# Altium schematic sheet STM32.SchDoc
size A4
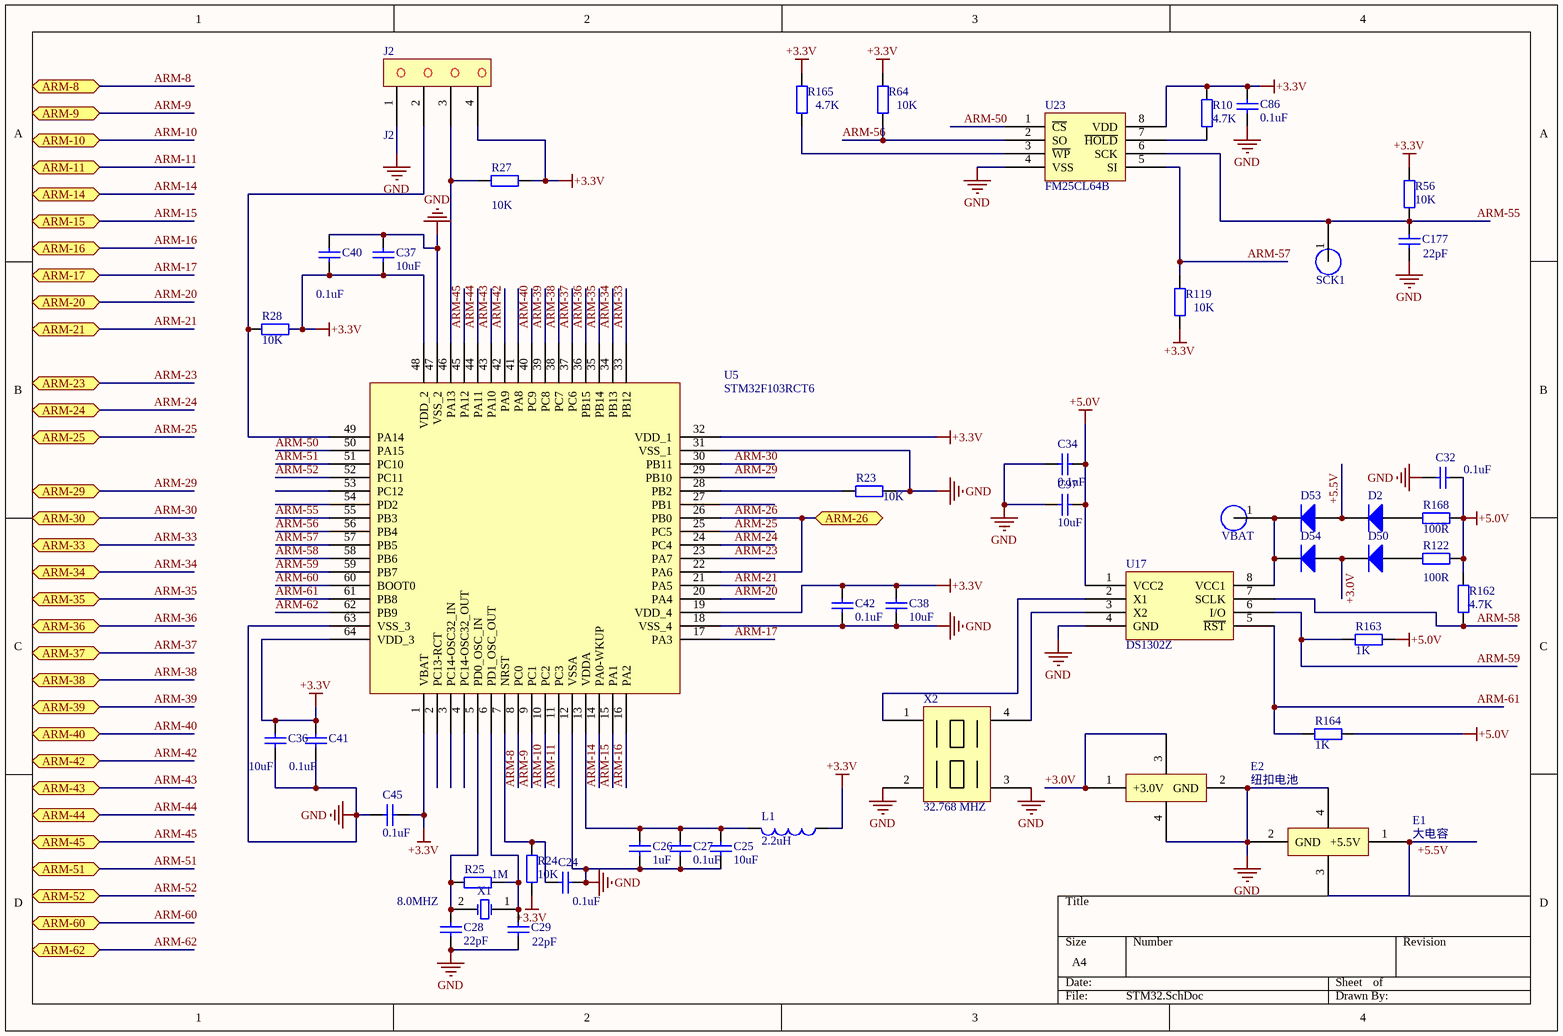
[diagram p0: STM32.SchDoc]

## Parts
C24  value 0.1uF  [C0805]  (hidden comment: Cap)
C25  value 10uF  [C1206]  (hidden comment: Cap)
C26  value 1uF  [C0805]  (hidden comment: Cap)
C27  value 0.1uF  [C0805]  (hidden comment: Cap)
C28  value 22pF  [C0805]  (hidden comment: Cap)
C29  value 22pF  [C0805]  (hidden comment: Cap)
C32  value 0.1uF  [C0805]  (hidden comment: Cap)
C34  value 0.1uF  [C0805]  (hidden comment: Cap)
C36  value 10uF  [C1206]  (hidden comment: Cap)
C37  value 10uF  [C1206]  (hidden comment: Cap)
C38  value 10uF  [C1206]  (hidden comment: Cap)
C40  value 0.1uF  [C0805]  (hidden comment: Cap)
C41  value 0.1uF  [C0805]  (hidden comment: Cap)
C42  value 0.1uF  [C0805]  (hidden comment: Cap)
C45  value 0.1uF  [C0805]  (hidden comment: Cap)
C86  value 0.1uF  [C86单独封装]  (hidden comment: Cap)
C97  value 10uF  [C1206]  (hidden comment: Cap)
C177  value 22pF  [C0805]  (hidden comment: Cap)
D2  Diode 1N4001  [SOD123]  (value not drawn)
D50  Diode 1N4001  [SOD123]  (value not drawn)
D53  Diode 1N4001  [SOD123]  (value not drawn)
D54  Diode 1N4001  [SOD123]  (value not drawn)
E1  大电容  [法拉电容电池]
E2  纽扣电池  [法拉电容电池]
J2  J2  [J2DIP]
L1  value 2.2uH  [R0805]  (hidden comment: Inductor)
R10  value 4.7K  [R0805]  (hidden comment: Res2)
R23  value 10K  [R0805]  (hidden comment: Res2)
R24  value 10K  [R0805]  (hidden comment: Res2)
R25  value 1M  [R0805]  (hidden comment: Res2)
R27  value 10K  [R0805]  (hidden comment: Res2)
R28  value 10K  [R0805]  (hidden comment: Res2)
R56  value 10K  [R0805]  (hidden comment: Res2)
R64  value 10K  [R0805]  (hidden comment: Res2)
R119  value 10K  [R0805]  (hidden comment: Res2)
R122  value 100R  [R1206]  (hidden comment: Res2)
R162  value 4.7K  [R0805]  (hidden comment: Res2)
R163  value 1K  [R0805]  (hidden comment: Res2)
R164  value 1K  [R0805]  (hidden comment: Res2)
R165  value 4.7K  [R0805]  (hidden comment: Res2)
R168  value 100R  [R1206]  (hidden comment: Res2)
SCK1  PIN  [圆形焊盘]  (value not drawn)
U5  STM32F103RCT6  [LQFP64]
U17  DS1302Z  [SOP-8]
U23  FM25CL64B  [SOIC-8]
VBAT  PIN  [圆形焊盘]  (value not drawn)
X1  value 8.0MHZ  [5032-2P]  (hidden comment: XTAL)
X2  32.768 MHZ  [黑色3*8-4]

## Ports
ARM-8, ARM-9, ARM-10, ARM-11, ARM-14, ARM-15, ARM-16, ARM-17, ARM-20, ARM-21, ARM-23, ARM-24, ARM-25, ARM-26, ARM-29, ARM-30, ARM-33, ARM-34, ARM-35, ARM-36, ARM-37, ARM-38, ARM-39, ARM-40, ARM-42, ARM-43, ARM-44, ARM-45, ARM-51, ARM-52, ARM-60, ARM-62

## Nets
+3.3V: C36.2 C37.2 C38.2 C40.1 C41.1 C42.2 C45.1 C86.2 J2.4 L1.1 R10.1 R24.1 R27.2 R28.2 R56.1 R64.2 R119.1 R165.2 U5.1(VBAT) U5.19(VDD_4) U5.32(VDD_1) U5.48(VDD_2) U5.64(VDD_3) U23.8(VDD)
+5.0V: C32.2 C34.1 C97.1 R122.2 R162.1 R163.1 R164.2 R168.1 U17.1(VCC2)
GND: C24.1 C25.1 C26.1 C27.1 C28.2 C29.1 C32.1 C34.2 C36.1 C37.1 C38.1 C40.2 C41.2 C42.1 C45.2 C86.1 C97.2 C177.2 E1.2(GND) E1.4 E2.2(GND) E2.4 J2.1 R23.2 U5.12(VSSA) U5.18(VSS_4) U5.31(VSS_1) U5.47(VSS_2) U5.63(VSS_3) U17.4(GND) U23.4(VSS) X2.2 X2.3
+3.0V: D50.2(K) D54.1(A) E2.1(+3.0V) E2.3
+5.5V: D2.2(K) D53.1(A) E1.1(+5.5V) E1.3
ARM-8: U5.8(PC0) ; port ARM-8
ARM-9: U5.9(PC1) ; port ARM-9
ARM-10: U5.10(PC2) ; port ARM-10
ARM-11: U5.11(PC3) ; port ARM-11
ARM-14: U5.14(PA0-WKUP) ; port ARM-14
ARM-15: U5.15(PA1) ; port ARM-15
ARM-16: U5.16(PA2) ; port ARM-16
ARM-17: U5.17(PA3) ; port ARM-17
ARM-20: U5.20(PA4) ; port ARM-20
ARM-21: U5.21(PA5) ; port ARM-21
ARM-23: U5.23(PA7) ; port ARM-23
ARM-24: U5.24(PC4) ; port ARM-24
ARM-25: U5.25(PC5) ; port ARM-25
ARM-26: U5.22(PA6) U5.26(PB0) ; port ARM-26
ARM-29: U5.29(PB10) ; port ARM-29
ARM-30: U5.30(PB11) ; port ARM-30
ARM-33: U5.33(PB12) ; port ARM-33
ARM-34: U5.34(PB13) ; port ARM-34
ARM-35: U5.35(PB14) ; port ARM-35
ARM-36: U5.36(PB15) ; port ARM-36
ARM-37: U5.37(PC6) ; port ARM-37
ARM-38: U5.38(PC7) ; port ARM-38
ARM-39: U5.39(PC8) ; port ARM-39
ARM-40: U5.40(PC9) ; port ARM-40
ARM-42: U5.42(PA9) ; port ARM-42
ARM-43: U5.43(PA10) ; port ARM-43
ARM-44: U5.44(PA11) ; port ARM-44
ARM-45: U5.45(PA12) ; port ARM-45
ARM-50: U5.50(PA15) U23.1(~{CS})
ARM-51: U5.51(PC10) ; port ARM-51
ARM-52: U5.52(PC11) ; port ARM-52
ARM-55: C177.1 R56.2 SCK1.1 U5.55(PB3) U23.6(SCK)
ARM-56: R64.1 U5.56(PB4) U23.2(SO)
ARM-57: R119.2 U5.57(PB5) U23.5(SI)
ARM-58: R162.2 U5.58(PB6) U17.7(SCLK)
ARM-59: R163.2 U5.59(PB7) U17.6(I/O)
ARM-60: U5.60(BOOT0) ; port ARM-60
ARM-61: R164.1 U5.61(PB8) U17.5(~{RST})
ARM-62: U5.62(PB9) ; port ARM-62
NetC24_2: C24.2 R24.2 U5.7(NRST)
NetC25_2: C25.2 C26.2 C27.2 L1.2 U5.13(VDDA)
NetC28_1: C28.1 R25.2 U5.5(PD0_OSC_IN) X1.2(OSC2)
NetC29_2: C29.2 R25.1 U5.6(PD1_OSC_OUT) X1.1(OSC1)
NetD2_1: D2.1(A) R168.2
NetD50_1: D50.1(A) R122.1
NetD53_2: D53.2(K) D54.2(K) U17.8(VCC1) VBAT.1
NetJ2_2: J2.2 R28.1 U5.49(PA14)
NetJ2_3: J2.3 R27.1 U5.46(PA13)
NetR10_2: R10.2 U23.7(~{HOLD})
NetR23_1: R23.1 U5.28(PB2)
NetR165_1: R165.1 U23.3(~{WP})
NetU17_2: U17.2(X1) X2.1
NetU17_3: U17.3(X2) X2.4

Not connected (* = marked no-connect by the designer): U5 2(PC13-RCT) 3(PC14-OSC32_IN) 4(PC14-OSC32_OUT) 27(PB1) 41(PA8) 53(PC12) 54(PD2)

## Library data of the parts
C24-C29 C32 C34 C36-C38 C40-C42 C45 C86 C97 C177 = Cap: Capacitor; Published: 8-Jun-2000; LatestRevisionDate: 17-Jul-2002; LatestRevisionNote: Re-released for DXP Platform.; PackageReference: RAD-0.3; Publisher: Altium Limited
D2 D50 D53 D54 = Diode 1N4001: 1 Amp General Purpose Rectifier; Published: 8-Jun-2000; LatestRevisionDate: 17-Jul-2002; LatestRevisionNote: Re-released for DXP Platform.; DatasheetDocument: 1998; PackageDocument: Aug-1999; PackageReference: DO-41; Publisher: Altium Limited; Code_JEDEC: DO-204-AL; ComponentLink1Description: Manufacturer Link; ComponentLink1URL: http://www.fairchildsemi.com/; ComponentLink2Description: Datasheet; ComponentLink2URL: http://www.fairchildsemi.com/ds/1N%2F1N4001.pdf
E1 E2 J2 SCK1 U5 U17 U23 VBAT = Component_1
L1 = Inductor: Code_IEC: 1005; Published: 8-Jun-2000; LatestRevisionDate: 17-Jul-2002; LatestRevisionNote: Re-released for DXP Platform.; PackageReference: 0402-A; Publisher: Altium Limited; Code_JEITA: 0402
R10 R23-R25 R27 R28 R56 R64 R119 R122 R162-R165 R168 = Res2: Resistor; Published: 8-Jun-2000; LatestRevisionDate: 17-Jul-2002; LatestRevisionNote: Re-released for DXP Platform.; PackageReference: AXIAL-0.4; Publisher: Altium Limited
X1 = XTAL: Crystal Oscillator; Published: 8-Jun-2000; LatestRevisionDate: 17-Jul-2002; LatestRevisionNote: Re-released for DXP Platform.; PackageReference: R38; Publisher: Altium Limited
X2 = Component_1: Value: 23.768MHZ